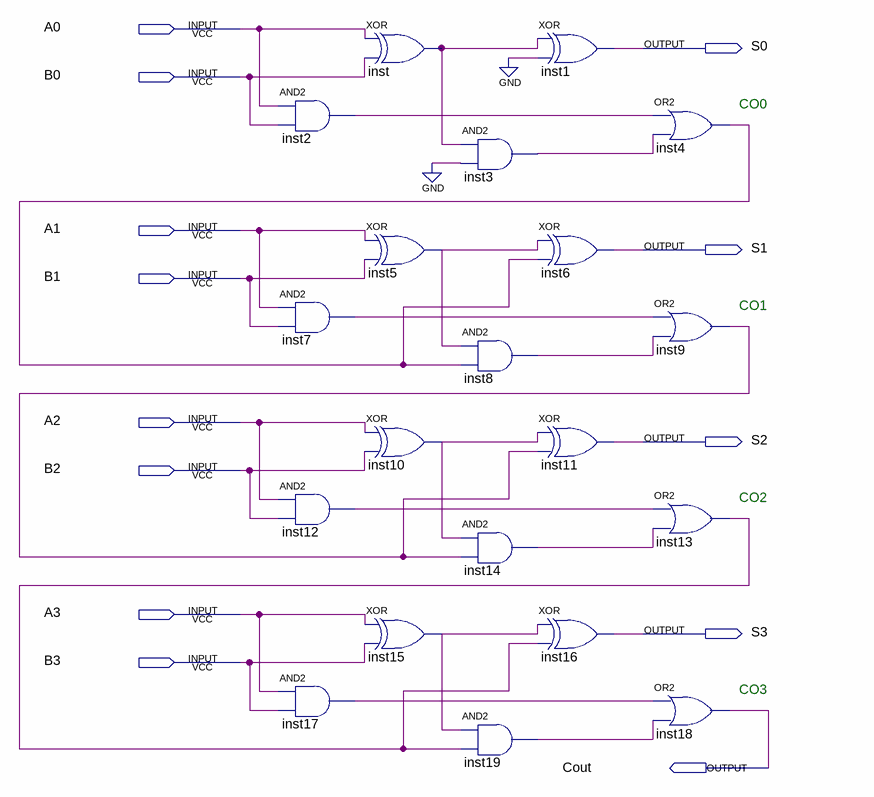
[diagram p0: schematic sheet]
// Quartus schematic Adder.bdf as structural Verilog: 20 symbols, 13 pins
module Adder (
  input  A0,
  input  B0,
  input  A1,
  input  B1,
  input  A2,
  input  B2,
  input  A3,
  input  B3,
  output S0,
  output S1,
  output S2,
  output S3,
  output Cout
);

  wire inst2_out, inst3_out, inst4_out, inst5_out, inst7_out, inst8_out, inst9_out, inst10_out, inst12_out,
       inst13_out, inst14_out, inst15_out, inst17_out, inst19_out, inst_out;

  and inst2 (inst2_out, A0, B0);
  and inst7 (inst7_out, A1, B1);
  and inst12 (inst12_out, A2, B2);
  and inst17 (inst17_out, A3, B3);
  xor inst (inst_out, A0, B0);
  xor inst5 (inst5_out, A1, B1);
  xor inst10 (inst10_out, A2, B2);
  xor inst15 (inst15_out, A3, B3);
  and inst3 (inst3_out, inst_out, 1'b0);
  and inst8 (inst8_out, inst5_out, inst4_out);
  and inst14 (inst14_out, inst10_out, inst9_out);
  and inst19 (inst19_out, inst15_out, inst13_out);
  xor inst1 (S0, inst_out, 1'b0);
  xor inst6 (S1, inst5_out, inst4_out);
  xor inst11 (S2, inst10_out, inst9_out);
  xor inst16 (S3, inst15_out, inst13_out);
  or inst4 (inst4_out, inst2_out, inst3_out);
  or inst9 (inst9_out, inst7_out, inst8_out);
  or inst13 (inst13_out, inst12_out, inst14_out);
  or inst18 (Cout, inst17_out, inst19_out);

  // Notes on the sheet:
  //   CO0
  //   CO1
  //   CO2
  //   CO3
endmodule
